# EAGLE design h_bridge (EAGLE 7.5.0)
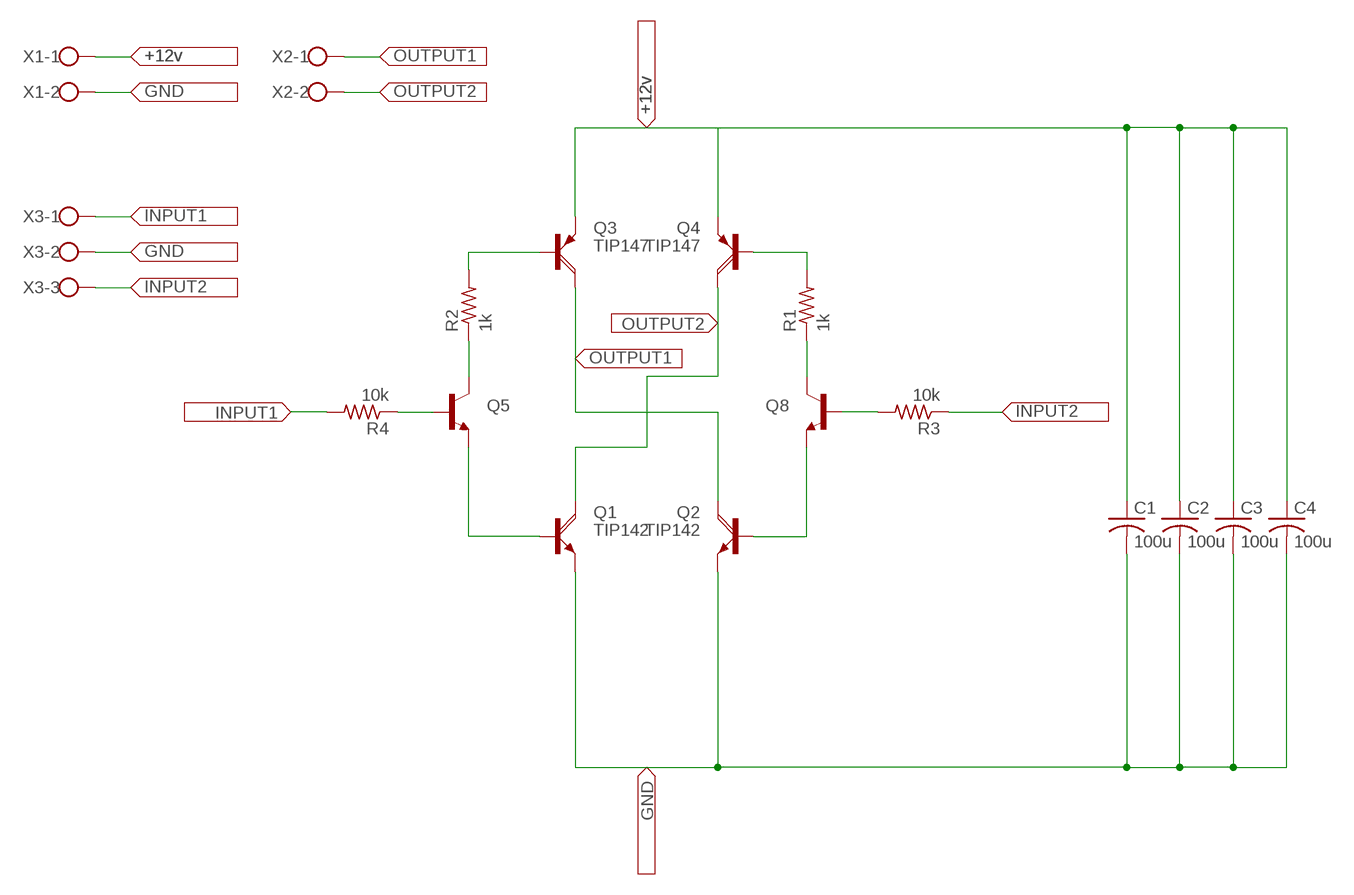
[diagram p0: schematic, sheet 1]

## Parts
C1  100u  C-US025-025X050  [C025-025X050]
C2  100u  C-US025-025X050  [C025-025X050]
C3  100u  C-US025-025X050  [C025-025X050]
C4  100u  C-US025-025X050  [C025-025X050]
Q1  TIP142  [SOT93]
Q2  TIP142  [SOT93]
Q3  TIP147  [SOT93]
Q4  TIP147  [SOT93]
Q5  TRANSISTOR_NPNTO92  [TO-92]
Q8  TRANSISTOR_NPNTO92  [TO-92]
R1  1k  R-US_0207/15  [0207/15]
R2  1k  R-US_0207/15  [0207/15]
R3  10k  R-US_0207/15  [0207/15]
R4  10k  R-US_0207/15  [0207/15]
X1  W237-02P  [W237-132]
X2  W237-02P  [W237-132]
X3  W237-03P  [W237-133]

## Nets
+12V: C1.1 C2.1 C3.1 C4.1 Q3.E Q4.E X1.1
GND: C1.2 C2.2 C3.2 C4.2 Q1.E Q2.E X1.2 X3.2
INPUT1: R4.2 X3.1
INPUT2: R3.1 X3.3
N$1: Q5.3(C) R2.1
N$2: Q3.B R2.2
N$3: Q4.B R1.2
N$4: Q8.3(C) R1.1
N$5: Q1.B Q5.1(E)
N$6: Q2.B Q8.1(E)
N$7: Q5.2(B) R4.1
N$8: Q8.2(B) R3.2
OUTPUT1: Q2.C Q3.C X2.1
OUTPUT2: Q1.C Q4.C X2.2

## Library data of the parts
C1-C4 = resistor:C-US: CAPACITOR, American symbol
Q1 Q2 = transistor-power:TIP142: NPN DARLINGTON TRANSISTOR
Q3 Q4 = transistor-power:TIP147: PNP DARLINGTON TRANSISTOR
Q5 Q8 = SparkFun:TRANSISTOR_NPN: Transistor NPN BJT configuration in SOT23 package. MMBT2222 is the common NPN we use. Double check BCE configuration again layout.
R1-R4 = resistor:R-US_: RESISTOR, American symbol
X1 X2 = con-wago-508:W237-02P: WAGO SREW CLAMP
X3 = con-wago-508:W237-03P: WAGO SREW CLAMP

## Board
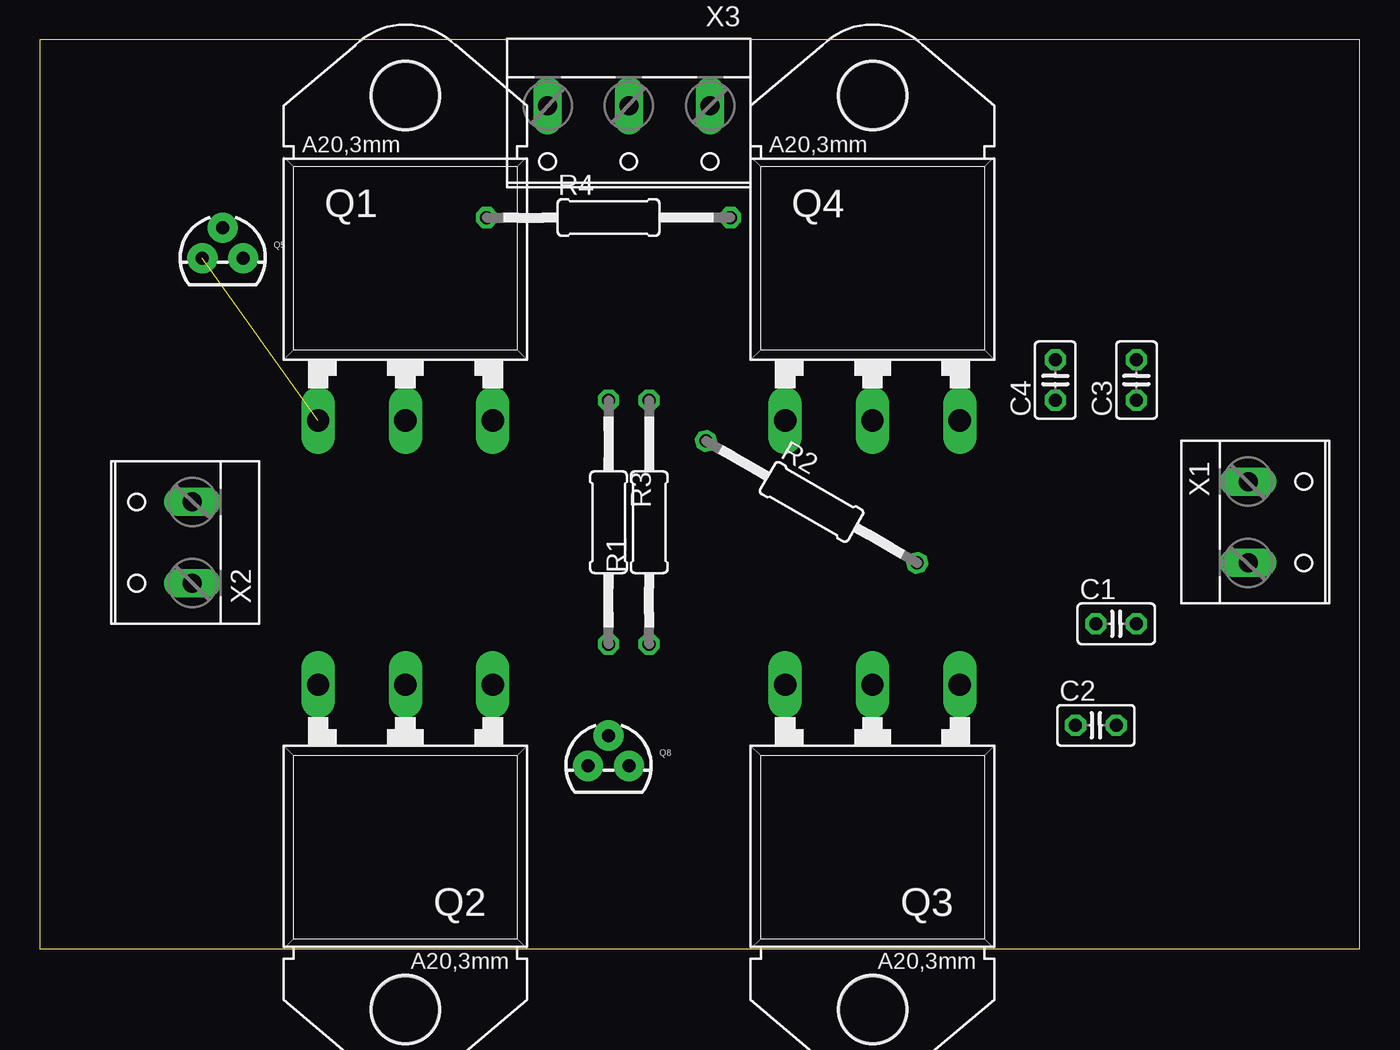
[diagram p1: board, top side]
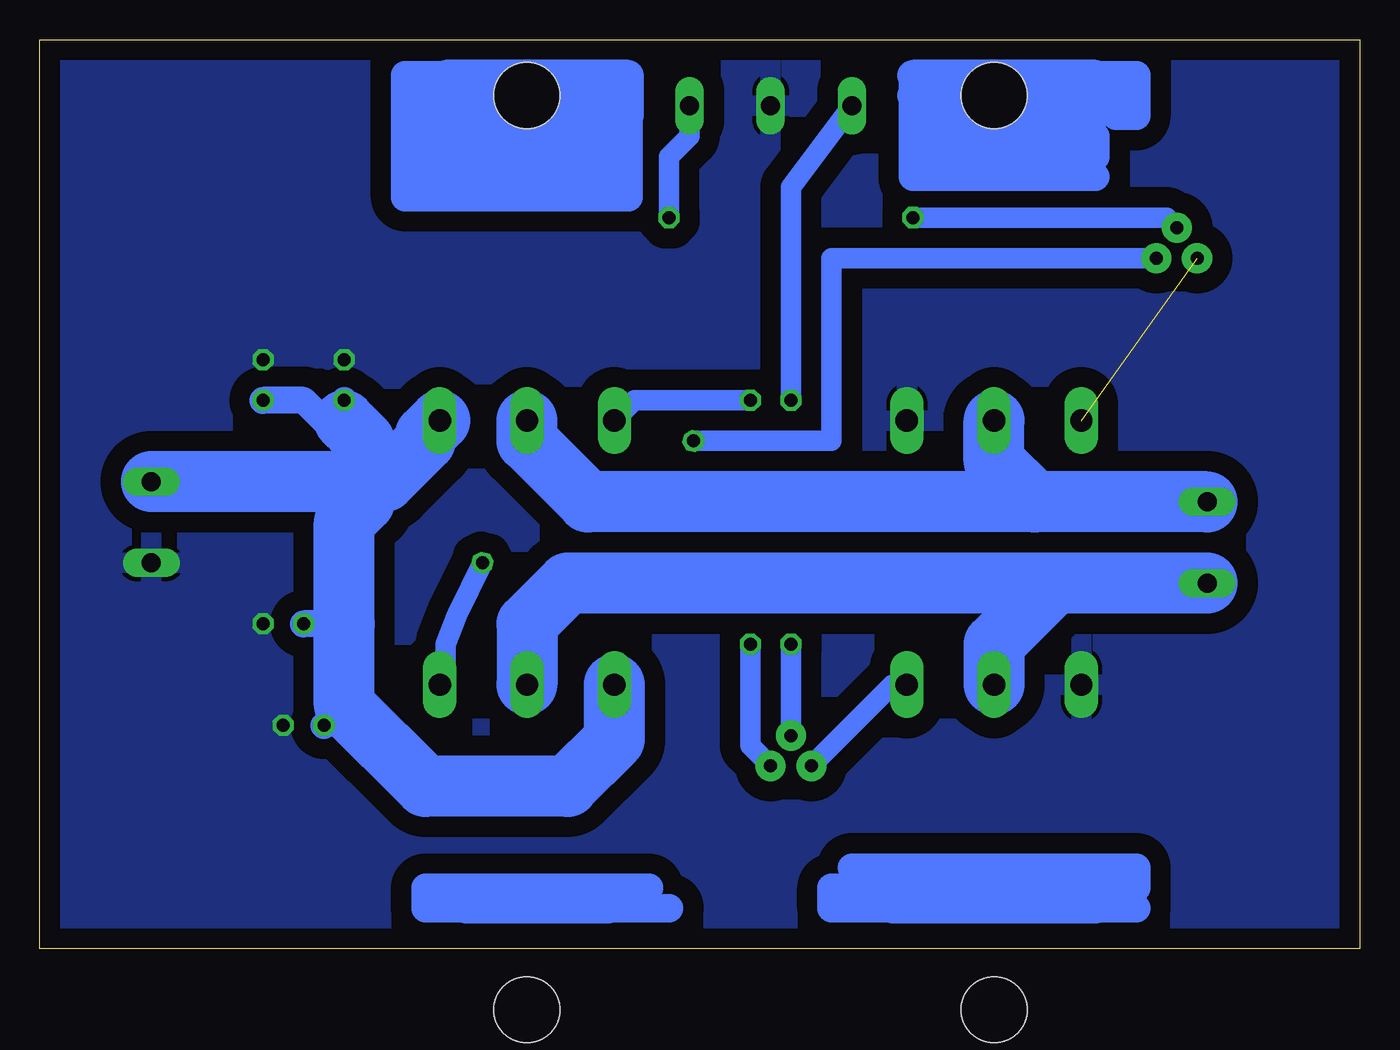
[diagram p2: board, bottom side, seen from below]

Size 82.53 x 56.82 mm. Coordinates in mm from the lower left corner, seen from the top.
Outline: 0,0 82.53,0 82.53,56.82 0,56.82 0,0
Copper layers (1*16): Top 0.035mm / dielectric 1.5mm / Bottom 0.035mm
Design rules "default": minimum track width 10mil, minimum drill 24mil, track to track 8mil, track to pad 8mil, pad to pad 8mil, via to via 8mil, smd to smd 8mil, copper to edge 40mil, drill to drill 8mil, minimum pad ring 10mil, minimum via ring 8mil, stop-mask expansion 4mil, vias tented up to drill 0mil, thermal gap 10mil

### Footprints (pad centres in the part's own frame; a part is rotated, then mirrored left to right if it is on the bottom)
C025-025X050 = drill 0.813 octagon: 1 -1.27,0; 2 1.27,0
SOT93 = drill 1.397 long: B -5.461,-10.16; C 0,-10.16; E 5.461,-10.16 | hole 4.115: 0,10.16
TO-92 = drill 0.813 pad 1.88: 1 -1.27,0; 2 0,1.905; 3 1.27,0
0207/15 = drill 0.813 octagon: 1 -7.62,0; 2 7.62,0
W237-132 = drill 1.194 long: 1 -2.54,-0.635; 2 2.54,-0.635
W237-133 = drill 1.194 long: 1 -5.08,-0.635; 2 0,-0.635; 3 5.08,-0.635

### Placement (x,y rotation side)
C1  67.31,20.32 0 top
C2  66.04,13.97 0 top
C3  68.58,35.56 90 top
C4  63.5,35.56 90 top
Q1  22.86,43.18 0 top
Q2  22.86,6.35 180 top
Q3  52.07,6.35 180 top
Q4  52.07,43.18 0 top
Q5  11.43,43.18 0 top
Q8  35.56,11.43 0 top
R1  38.1,26.67 90 top
R2  48.26,27.94 330 top
R3  35.56,26.67 270 top
R4  35.56,45.72 0 top
X1  76.2,26.67 270 top
X2  8.89,25.4 90 top
X3  36.83,52.07 180 top

### Tracks (layer width: path | path; a pad name or v marks a point on that pad's centre or on a via)
+12V
  Bottom 1.676: 63.5,20.32 C1.1 | 63.5,15.24 C2.1 | 63.5,31.75 C4.1 | 62.87,32.38 63.5,31.75 | C3.1 66.04,34.29 63.5,31.75 | 62.23,27.94 60.96,29.21
  Bottom 3.81: X1.1 60.96,29.21 58.42,31.75 58.42,32.13 Q4.E | Q3.E 46.61,13.08 49.53,10.16 58.42,10.16 63.5,15.24 63.5,20.32 63.5,26.67 62.23,27.94 62.23,31.75 62.87,32.38 63.5,33.02
GND
  pour Bottom (isolate 1.27): 0,57.15 82.55,55.88 82.55,0 0,0
INPUT1
  Bottom 1.27: R4.2 43.18,49.53 41.91,50.8 X3.1
INPUT2
  Bottom 1.27: R3.1 35.56,47.62 X3.3
N$1
  Bottom 1.27: R2.1 33.02,31.75 33.02,43.18 Q5.3
N$2
  Bottom 1.27: R2.2 56.45,20.89 57.15,19.05 57.15,16.89 Q3.B
N$3
  Bottom 1.27: R1.2 45.34,34.29 Q4.B
N$4
  Bottom 1.27: Q8.3 38.1,12.7 R1.1
N$5  (1 unrouted)
N$6
  Bottom 1.27: Q2.B 29.21,16.51 Q8.1
N$7
  Bottom 1.27: R4.1 12.06,45.72 Q5.2
N$8
  Bottom 1.27: Q8.2 R3.2
N$9
  Bottom 1.778: 13.97,2.54 33.02,2.54 33.02,3.81 13.97,3.81 13.97,5.08 31.75,5.08
N$10
  Bottom 1.93: 16.51,2.54 29.21,2.54 29.21,3.81 17.78,3.81
N$12
  Bottom 1.93: 46.99,2.54 55.88,2.54
N$14
  Bottom 1.778: 45.72,54.61 45.72,46.99 59.69,46.99 59.69,54.61 46.99,54.61 46.99,48.26 58.42,48.26 58.42,53.34 48.26,53.34 48.26,49.53 57.15,49.53 57.15,52.07 53.34,52.07 53.34,50.8 55.88,50.8
  Bottom 1.93: 57.15,54.61 45.72,54.61 45.72,52.07 55.88,52.07 55.88,53.34 48.26,53.34 48.26,50.8 52.07,50.8
N$15
  Bottom 1.778: 16.51,48.26 27.94,48.26 27.94,54.61 13.97,54.61 13.97,52.07 15.24,52.07 15.24,53.34 16.51,53.34 16.51,52.07 26.67,52.07 26.67,49.53 16.51,49.53 16.51,50.8 25.4,50.8
  Bottom 1.93: 27.94,54.61 16.51,54.61 16.51,53.34 26.67,53.34 | 26.67,53.34 27.94,53.34 | 26.67,53.34 26.67,52.07 19.05,52.07 19.05,50.8 22.86,50.8
N$16
  Bottom 1.778: 43.18,2.54 58.42,2.54 58.42,3.81 44.45,3.81
OUTPUT1
  Bottom 3.81: X2.1 19.05,22.86 | 19.05,22.86 49.53,22.86 52.07,20.32 Q3.C | Q2.C 22.86,19.05 19.05,22.86
OUTPUT2
  Bottom 3.81: X2.2 20.32,27.94 | 20.32,27.94 22.86,30.48 Q1.C | Q4.C 52.07,31.75 48.26,27.94 20.32,27.94